# EAGLE design midi-in-board (EAGLE 7.5.0)
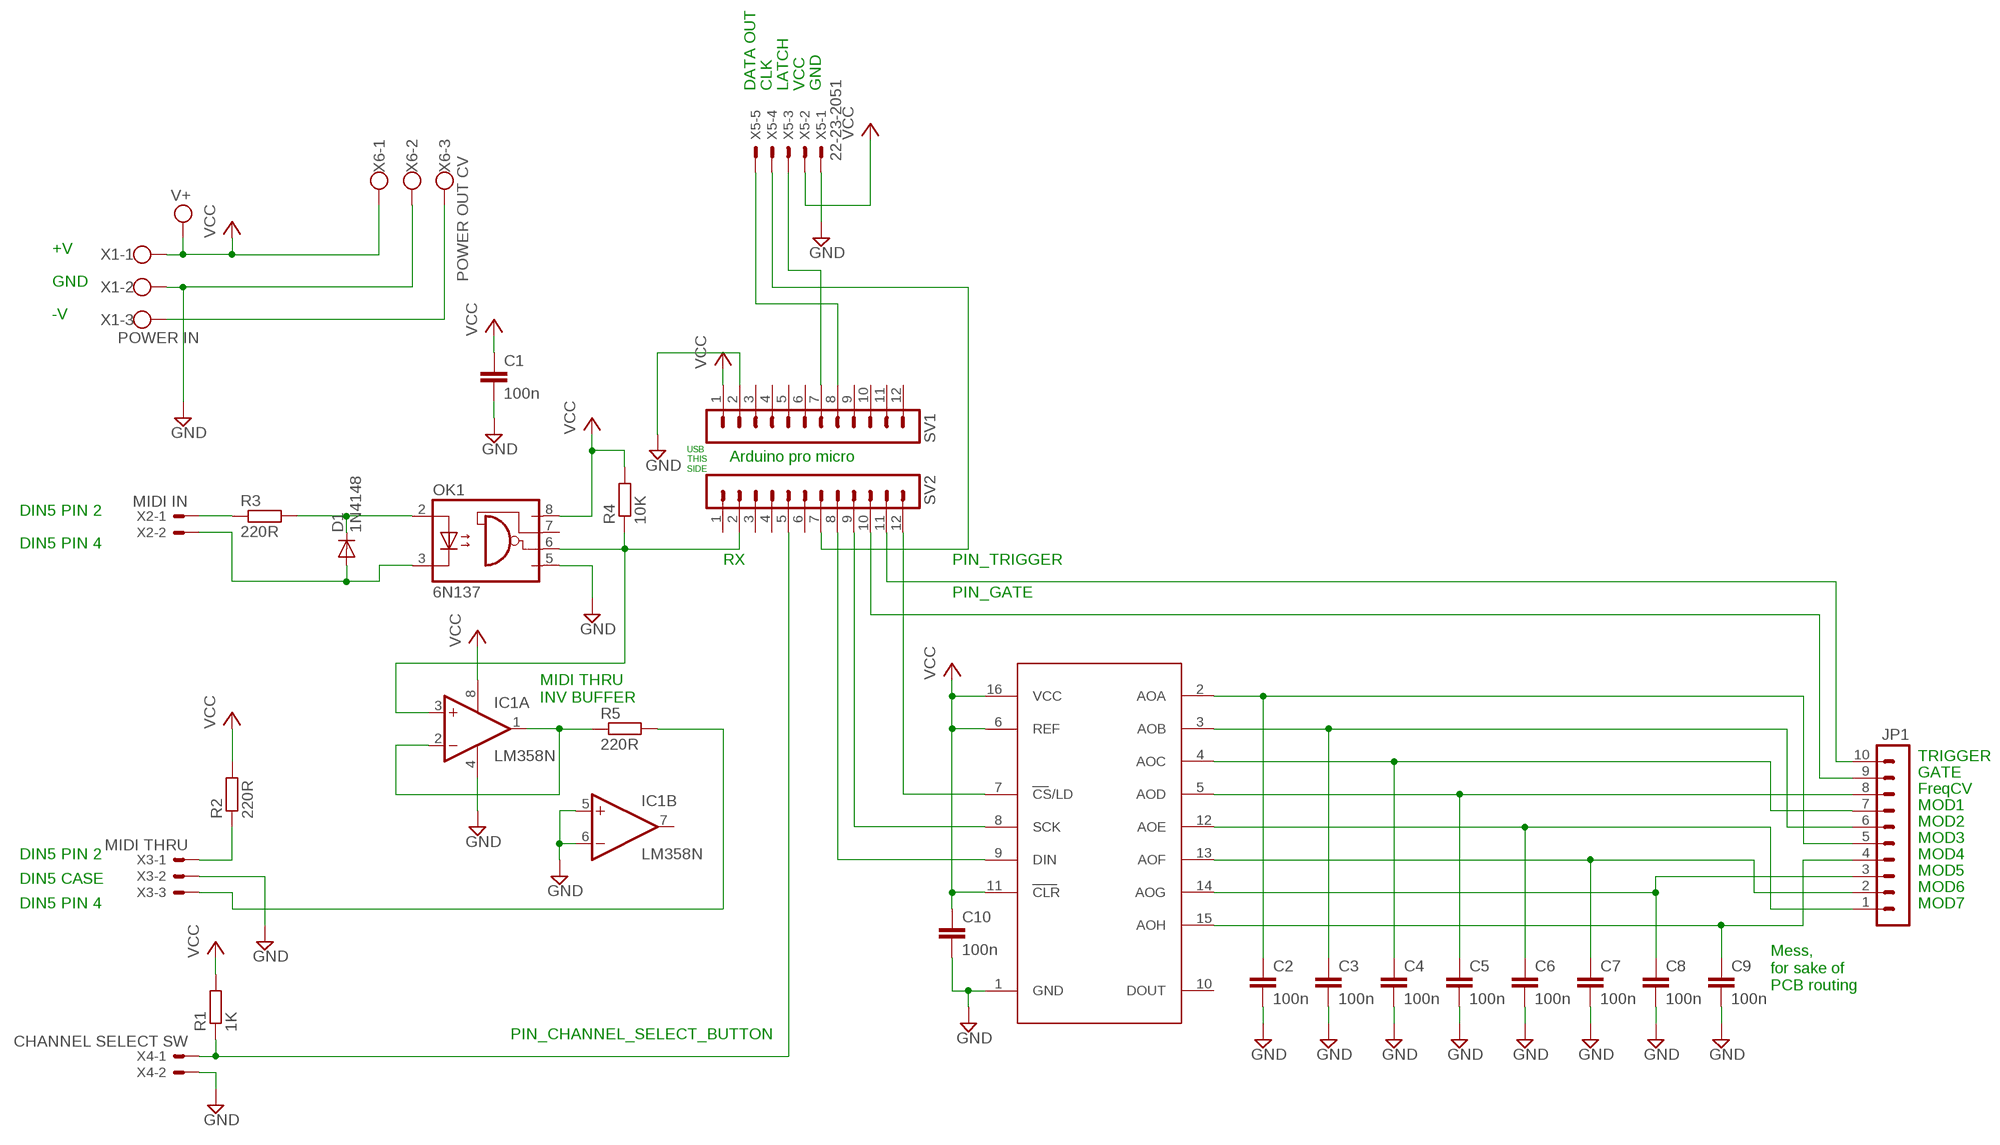
[diagram p0: schematic, sheet 1]

## Parts
C1  100n  C-EU050-024X044  [C050-024X044]
C2  100n  C-EU050-024X044  [C050-024X044]
C3  100n  C-EU050-024X044  [C050-024X044]
C4  100n  C-EU050-024X044  [C050-024X044]
C5  100n  C-EU050-024X044  [C050-024X044]
C6  100n  C-EU050-024X044  [C050-024X044]
C7  100n  C-EU050-024X044  [C050-024X044]
C8  100n  C-EU050-024X044  [C050-024X044]
C9  100n  C-EU050-024X044  [C050-024X044]
C10  100n  C-EU050-024X044  [C050-024X044]
D1  1N4148  1N4148DO35-7  [DO35-7]
IC1  LM358N  [DIL08]
JP1  MA10-1  [MA10-1]
OK1  6N137  [DIL08]
R1  1K  R-EU_0207/7  [0207/7]
R2  220R  R-EU_0207/7  [0207/7]
R3  220R  R-EU_0207/7  [0207/7]
R4  10K  R-EU_0207/7  [0207/7]
R5  220R  R-EU_0207/7  [0207/7]
SV1  MA12-1  [MA12-1]
SV2  MA12-1  [MA12-1]
U$1  LTC1660  [DIL16]
X1  POWER IN  W237-103  [W237-103]
X2  MIDI IN  22-23-2021  [22-23-2021]
X3  MIDI THRU  22-23-2031  [22-23-2031]
X4  CHANNEL SELECT SW  22-23-2021  [22-23-2021]
X5  22-23-2051  [22-23-2051]
X6  POWER OUT CV  W237-103  [W237-103]

## Nets
GND: C1.2 C2.2 C3.2 C4.2 C5.2 C6.2 C7.2 C8.2 C9.2 C10.2 IC1.4(P:V-) IC1.5(B:+IN) IC1.6(B:-IN) OK1.5(GND) SV1.2 U$1.1(GND) X1.2 X3.2 X4.2 X5.1 X6.2
N$1: R3.1 X2.1
N$2: D1.C OK1.2(A) R3.2
N$3: D1.A OK1.3(C) X2.2
N$4: IC1.1(A:OUT) IC1.2(A:-IN) R5.1
N$5: IC1.3(A:+IN) OK1.6(VO) R4.1 SV2.2
N$6: R2.1 X3.1
N$7: R5.2 X3.3
N$9: SV1.8 X5.5
N$10: X1.3 X6.3
N$11: JP1.10 SV2.11
N$12: JP1.9 SV2.10
N$14: R1.1 SV2.5 X4.1
N$16: SV2.9 U$1.8(SCK)
N$17: SV2.8 U$1.9(DIN)
N$22: C2.1 JP1.5 U$1.2(AOA)
N$23: SV2.12 U$1.7(CS/LD)
N$24: SV2.7 X5.4
N$26: SV1.7 X5.3
N$27: C3.1 JP1.6 U$1.3(AOB)
N$31: C6.1 JP1.1 U$1.12(AOE)
N$33: C4.1 JP1.7 U$1.4(AOC)
N$34: C5.1 JP1.8 U$1.5(AOD)
N$36: C7.1 JP1.2 U$1.13(AOF)
N$37: C8.1 JP1.3 U$1.14(AOG)
N$38: C9.1 JP1.4 U$1.15(AOH)
VCC: C1.1 C10.1 IC1.8(P:V+) OK1.8(VCC) R1.2 R2.2 R4.2 SV1.1 U$1.6(REF) U$1.11(CLR) U$1.16(VCC) X1.1 X5.2 X6.1 ; supply symbol labelled V+
Unconnected: IC1.7(B:OUT) OK1.7(VE) SV1.3 SV1.4 SV1.5 SV1.6 SV1.9 SV1.10 SV1.11 SV1.12 SV2.1 SV2.3 SV2.4 SV2.6 U$1.10(DOUT)

## Notes on the sheet
- DATA OUT | CLK | LATCH | VCC | GND
- +V
- GND
- -V
- Arduino pro micro
- USB
  THIS
  SIDE
- DIN5 PIN 2
- DIN5 PIN 4
- RX | PIN_TRIGGER
- PIN_GATE
- MIDI THRU
  INV BUFFER
- TRIGGER
- GATE
- FreqCV
- MOD1
- MOD2
- MOD3
- DIN5 PIN 2 | MOD4
- MOD5
- DIN5 CASE
- MOD6
- DIN5 PIN 4 | MOD7
- Mess,
  for sake of
  PCB routing
- PIN_CHANNEL_SELECT_BUTTON

## Library data of the parts
C1-C10 = rcl:C-EU: CAPACITOR, European symbol
D1 = diode:1N4148: DIODE high speed (Philips)
IC1 = linear:LM358: OP AMP also LM158; LM258; LM2904 Source: http://cache.national.com/ds/LM/LM158.pdf
JP1 = con-lstb:MA10-1: PIN HEADER; OC_FARNELL: unknown; OC_NEWARK: unknown
OK1 = optocoupler:6N137: MOTOROLA OPTO COUPLER; MPN: 6N137; OC_FARNELL: 1328376; OC_NEWARK: 52M1895
R1-R5 = rcl:R-EU_: RESISTOR, European symbol
SV1 SV2 = con-lstb:MA12-1: PIN HEADER; OC_FARNELL: unknown; OC_NEWARK: unknown
U$1 = LTC1660:LTC1660: Micropower octal 10-Bit DAC
X1 X6 = con-wago-500:W237-103: WAGO SCREW CLAMP; MPN: 237-103; OC_FARNELL: unknown; OC_NEWARK: 18M7116
X2 X4 = con-molex:22-23-2021: .100" (2.54mm) Center Header - 2 Pin; MF: MOLEX; MPN: 22-23-2021; OC_FARNELL: 1462926; OC_NEWARK: 25C3832
X3 = con-molex:22-23-2031: .100" (2.54mm) Center Header - 3 Pin; MF: MOLEX; MPN: 22-23-2031; OC_FARNELL: 1462950; OC_NEWARK: 30C0862
X5 = con-molex:22-23-2051: .100" (2.54mm) Center Header - 5 Pin; MF: MOLEX; MPN: 22-23-2051; OC_FARNELL: 1462952; OC_NEWARK: 38C9178

## Board
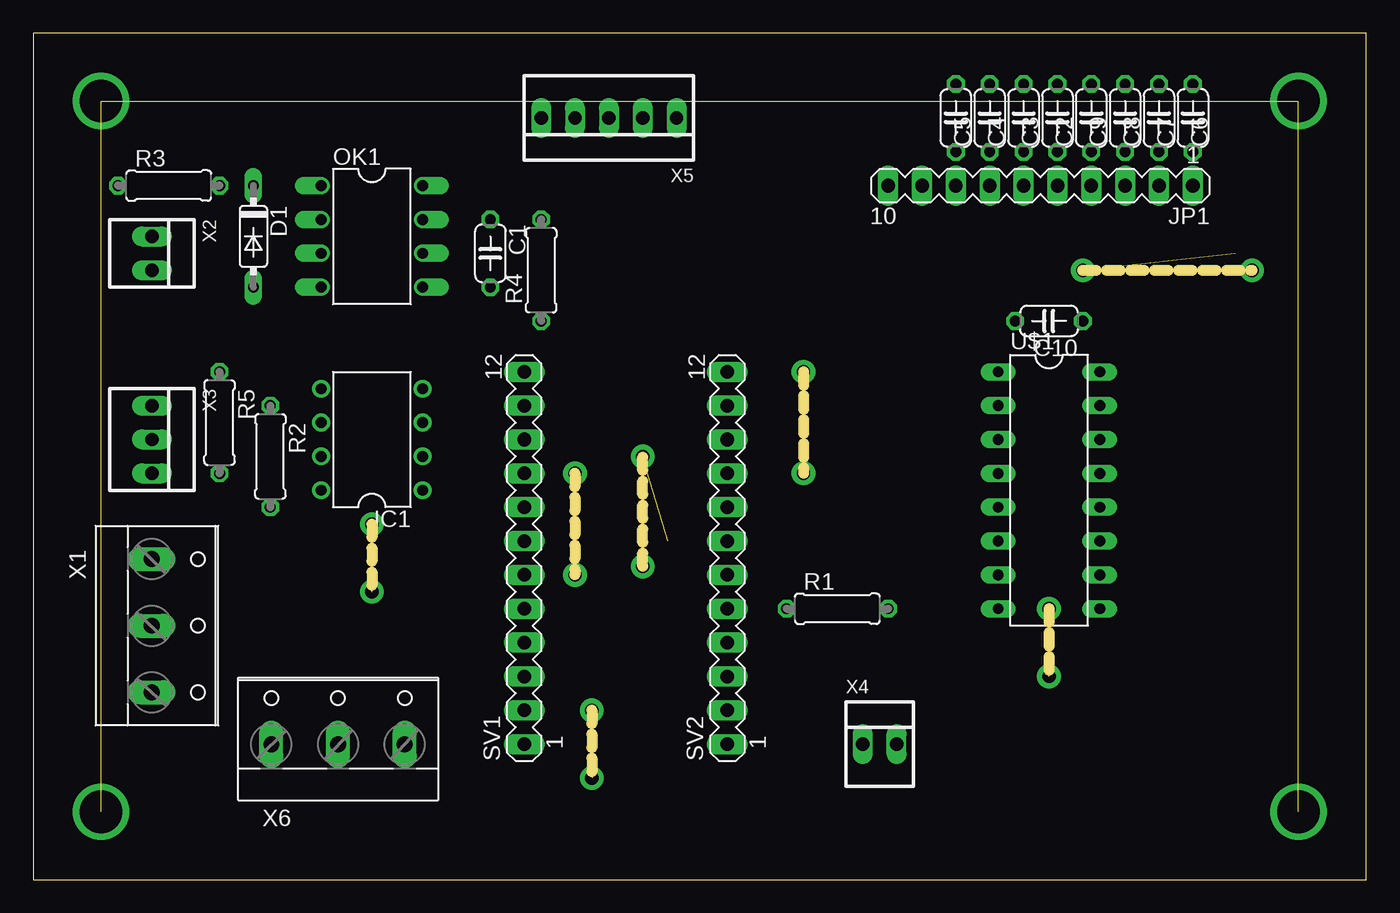
[diagram p1: board, top side]
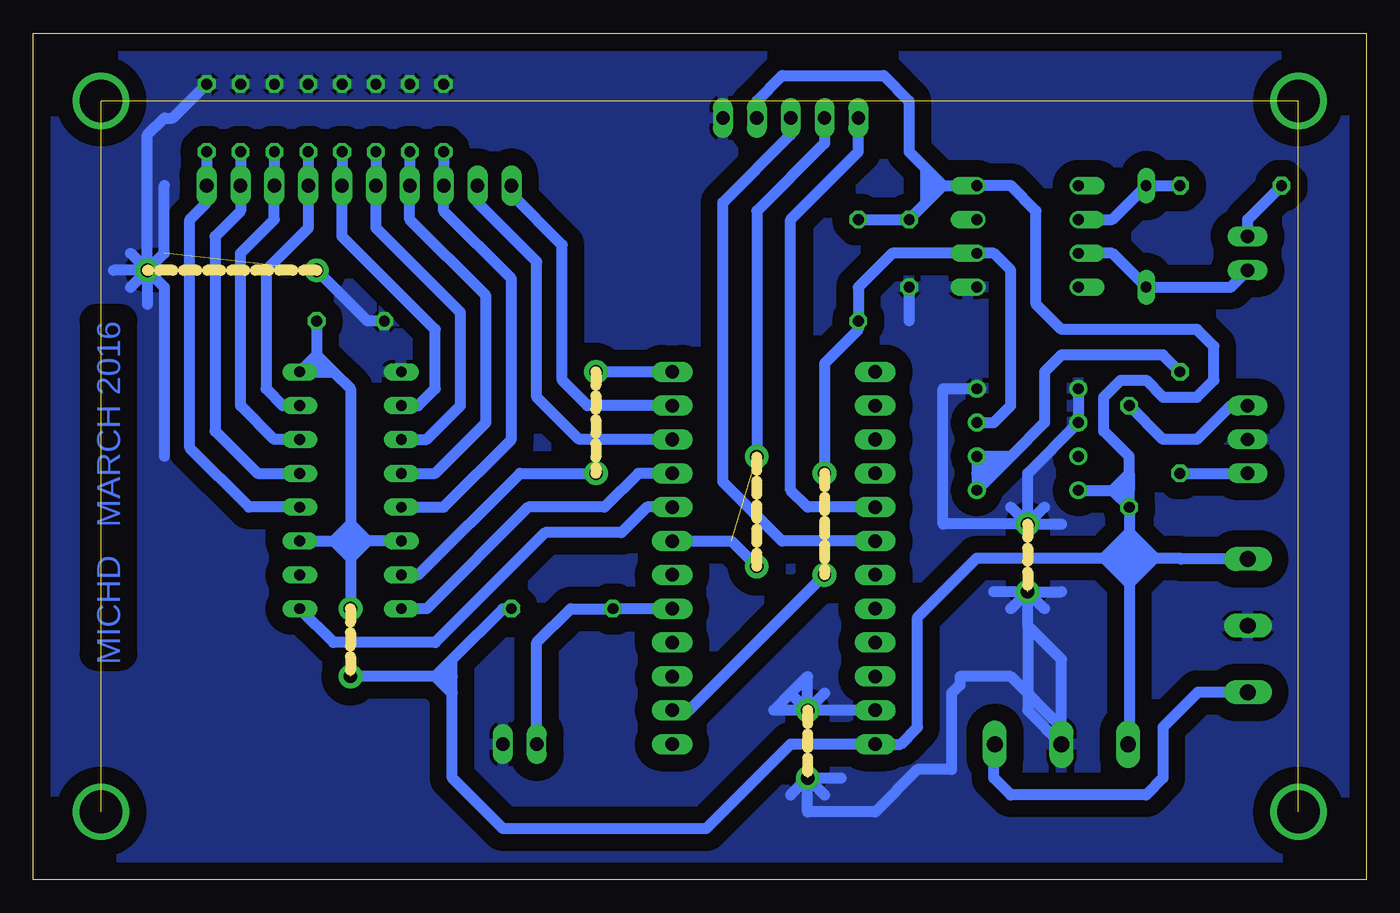
[diagram p2: board, bottom side, seen from below]

Size 100 x 63.5 mm. Coordinates in mm from the lower left corner, seen from the top.
Outline: 45.72,23.5 45.72,31.75
Outline: 40.64,30.48 40.64,22.86
Outline: 57.78,38.1 57.78,30.48
Outline: 76.2,20.32 76.2,15.24
Outline: 78.74,45.72 91.44,45.72
Outline: 25.4,26.67 25.4,21.59
Outline: 41.91,12.7 41.91,7.62
Outline: 0,0 100,0 100,63.5 0,63.5 0,0
Copper layers (1*16): Top 0.035mm / dielectric 1.5mm / Bottom 0.035mm
Design rules "default": minimum track width 10mil, minimum drill 24mil, track to track 8mil, track to pad 8mil, pad to pad 8mil, via to via 8mil, smd to smd 8mil, copper to edge 40mil, drill to drill 8mil, minimum pad ring 10mil, minimum via ring 8mil, stop-mask expansion 4mil, vias tented up to drill 0mil, thermal gap 10mil

### Footprints (pad centres in the part's own frame; a part is rotated, then mirrored left to right if it is on the bottom)
C050-024X044 = drill 0.813 octagon: 1 -2.54,0; 2 2.54,0
DO35-7 = drill 0.813 long: A 3.81,0; C -3.81,0
DIL08 = drill 0.813 pad 1.27: 1 -3.81,-3.81; 2 -1.27,-3.81; 3 1.27,-3.81; 4 3.81,-3.81; 5 3.81,3.81; 6 1.27,3.81; 7 -1.27,3.81; 8 -3.81,3.81
MA10-1 = drill 1.016 long: 1 -11.43,0; 2 -8.89,0; 3 -6.35,0; 4 -3.81,0; 5 -1.27,0; 6 1.27,0; 7 3.81,0; 8 6.35,0; 9 8.89,0; 10 11.43,0
DIL08' = drill 0.813 offset: 1 -3.81,-3.81; 2 -1.27,-3.81; 3 1.27,-3.81; 4 3.81,-3.81; 5 3.81,3.81; 6 1.27,3.81; 7 -1.27,3.81; 8 -3.81,3.81
0207/7 = drill 0.813 octagon: 1 -3.81,0; 2 3.81,0
MA12-1 = drill 1.016 long: 1 -13.97,0; 2 -11.43,0; 3 -8.89,0; 4 -6.35,0; 5 -3.81,0; 6 -1.27,0; 7 1.27,0; 8 3.81,0; 9 6.35,0; 10 8.89,0; 11 11.43,0; 12 13.97,0
DIL16 = drill 0.813 long: 1 -8.89,-3.81; 2 -6.35,-3.81; 3 -3.81,-3.81; 4 -1.27,-3.81; 5 1.27,-3.81; 6 3.81,-3.81; 7 6.35,-3.81; 8 8.89,-3.81; 9 8.89,3.81; 10 6.35,3.81; 11 3.81,3.81; 12 1.27,3.81; 13 -1.27,3.81; 14 -3.81,3.81; 15 -6.35,3.81; 16 -8.89,3.81
W237-103 = drill 1.194 long: 1 -5,-1.29; 2 0,-1.29; 3 5,-1.29
22-23-2021 = drill 1 long: 1 -1.27,0; 2 1.27,0
22-23-2031 = drill 1 long: 1 -2.54,0; 2 0,0; 3 2.54,0
22-23-2051 = drill 1 long: 1 -5.08,0; 2 -2.54,0; 3 0,0; 4 2.54,0; 5 5.08,0

### Placement (x,y rotation side)
C1  34.29,46.99 270 top
C2  76.83,57.15 90 top
C3  74.3,57.15 90 top
C4  71.75,57.15 90 top
C5  69.22,57.15 90 top
C6  87,57.15 90 top
C7  84.45,57.15 90 top
C8  81.92,57.15 90 top
C9  79.38,57.15 90 top
C10  76.2,41.91 180 top
D1  16.51,48.26 270 top
IC1  25.4,33.02 90 top
JP1  75.56,52.07 180 top
OK1  6N137  [DIL08']  25.4,48.26 270 top
R1  60.33,20.32 0 top
R2  17.78,31.75 270 top
R3  10.16,52.07 0 top
R4  38.1,45.72 90 top
R5  13.97,34.29 270 top
SV1  36.83,24.13 90 top
SV2  52.07,24.13 90 top
U$1  76.2,29.21 270 top
X1  10.16,19.05 270 top
X2  8.89,46.99 270 top
X3  8.89,33.02 270 top
X4  63.5,10.16 0 top
X5  43.18,57.15 180 top
X6  22.86,11.43 0 top

### Tracks (layer width: path | path; a pad name or v marks a point on that pad's centre or on a via)
GND  (via drill 1 pad 1.78)  (3 unrouted)
  Bottom 0.813: C1.2 34.29,41.91 | IC1.5 IC1.6 25.4,30.48 v25.4,26.67 | C10.2 74.93,41.91 78.74,45.72 | SV1.2 v41.91,12.7 | X6.2 22.86,10.16 | 22.86,11.43 22.86,16.51 25.4,19.05 | 25.4,19.05 v25.4,21.59 | v25.4,26.67 31.75,26.67 31.75,36.83 IC1.4 | 25.4,19.05 25.4,12.7 22.86,10.16 | 22.86,10.16 22.86,11.43 | 22.86,11.43 26.67,15.24 30.48,15.24 30.48,14.61 31.11,13.97 31.11,8.26 33.66,8.26 36.83,5.08 41.91,5.08 v41.91,7.62 | v41.91,12.7 41.91,15.24 43.18,13.97 | 43.18,13.97 44.45,12.7 v41.91,12.7 | v41.91,7.62 39.37,7.62 | v41.91,7.62 43.18,6.35 | v41.91,7.62 40.64,6.35 | v41.91,12.7 40.64,13.97 | v41.91,12.7 43.18,13.97 | v25.4,21.59 27.94,21.59 | v25.4,21.59 22.86,21.59 | v25.4,26.67 22.86,26.67 | v91.44,45.72 91.44,55.88 90.17,57.15 89.53,57.15 C6.2 | v91.44,45.72 93.98,45.72 | v91.44,45.72 91.44,43.18 | v91.44,45.72 92.71,44.45 | v91.44,45.72 92.71,46.99 | 90.17,52.07 90.17,46.99 v91.44,45.72 | v91.44,45.72 90.17,44.45 90.17,31.75 | v25.4,21.59 26.67,20.32 | v25.4,21.59 24.13,20.32 | v25.4,26.67 26.67,27.94 | v25.4,26.67 24.13,27.94
  pour Bottom (isolate 1.27): 1.27,62.23 98.73,62.23 98.73,1.27 1.27,1.27
N$1
  Bottom 0.813: X2.1 8.89,49.53 R3.1
N$2
  Bottom 0.813: R3.2 D1.C 19.05,49.53 OK1.2
N$3
  Bottom 0.813: OK1.3 19.05,46.99 D1.A 10.16,44.45 X2.2
N$4
  Bottom 0.813: 29.21,30.48 IC1.1 27.94,30.48 | R5.1 15.24,39.37 22.86,39.37 24.13,38.1 24.13,34.29 26.67,31.75 | 26.67,31.75 27.94,31.75 | 27.94,31.75 IC1.2 | 26.67,31.75 27.94,30.48 | 27.94,30.48 IC1.2 | IC1.2 29.21,30.48 | 29.21,30.48 27.94,30.48 | 27.94,30.48 27.94,31.75
N$5  (1 unrouted)
  Bottom 0.813: SV2.2 50.8,12.7 40.64,22.86 | IC1.3 27.94,34.29 26.67,35.56 26.67,45.72 27.94,46.99 OK1.6 35.56,46.99 38.1,44.45 R4.1 38.1,41.27 40.64,38.73 40.64,30.48
N$6
  Bottom 0.813: X3.1 10.16,35.56 12.7,33.02 15.24,33.02 R2.1
N$7
  Bottom 0.813: R5.2 X3.3
N$8  (via drill 1 pad 1.78)
  other vias: 57.78,38.1
N$9
  Bottom 0.813: SV1.8 41.91,27.94 43.18,29.21 43.18,49.53 38.1,54.61 X5.5
N$10
  Bottom 0.813: X1.3 12.62,14.05 15.24,11.43 15.24,7.62 16.51,6.35 26.67,6.35 27.94,7.62 27.94,10.06 X6.3
N$11
  Bottom 0.813: SV2.11 58.42,35.56 60.33,37.47 60.33,47.62 64.14,51.44 JP1.10
N$12
  Bottom 0.813: SV2.10 59.05,33.02 62.23,36.2 62.23,46.35 66.67,50.8 JP1.9
N$13  (via drill 1 pad 1.78)
  other vias: 57.78,30.48
N$14
  Bottom 0.813: SV2.5 R1.1 59.69,20.32 62.23,17.78 X4.1
N$15  (via drill 1 pad 1.78)
  other vias: 78.74,45.72
N$16
  Bottom 0.813: SV2.9 54.61,30.48 57.15,27.94 62.87,27.94 70.48,20.32 U$1.8
N$17
  Bottom 0.813: SV2.8 53.98,27.94 55.88,26.04 61.59,26.04 69.85,17.78 77.47,17.78 U$1.9
N$18  (via drill 1 pad 1.78)
  other vias: 76.2,20.32
N$19  (via drill 1 pad 1.78)
  other vias: 40.64,22.86
N$20  (via drill 1 pad 1.78)
  other vias: 40.64,30.48
N$21
  pour Bottom (isolate 1.27): 35.56,58.42 36.83,58.42 36.83,54.61 41.91,49.53 41.91,39.37 39.37,41.91 39.37,45.72 36.83,48.26 38.1,48.26 39.37,49.53 38.1,50.8 34.29,50.8 34.29,53.34 35.56,54.61
N$22
  Bottom 0.813: U$1.2 71.12,35.56 69.85,36.83 69.85,41.27 76.83,48.26 JP1.5 C2.1
N$23  (1 unrouted)
  Bottom 0.813: SV2.12 57.78,38.1 | U$1.7 71.12,22.86 63.5,30.48 57.78,30.48
N$24  (via drill 1 pad 1.78)  (1 unrouted)
  Bottom 0.813: SV2.7 47.62,25.4 | X5.4 40.64,55.24 45.72,50.16 v45.72,31.75 | 47.62,25.4 v45.72,23.5 47.62,25.4
N$26
  Bottom 0.813: SV1.7 43.81,25.4 48.26,29.84 48.26,50.8 43.18,55.88 X5.3
N$27
  Bottom 0.813: U$1.3 70.48,33.02 67.94,35.56 67.94,42.55 74.3,48.9 JP1.6 C3.1
N$28
  pour Bottom (isolate 1.27): 53.34,26.67 54.61,26.67 55.88,25.4 60.96,25.4 64.77,21.59 62.23,19.05 59.69,21.59 53.34,21.59
N$29
  pour Bottom (isolate 1.27): 49.53,24.13 49.53,15.24 41.91,22.86 41.91,24.13 44.45,24.13 44.45,22.86 46.99,22.86 48.26,24.13
N$31
  Bottom 0.813: U$1.12 83.82,27.94 88.27,32.38 88.27,49.53 87,50.8 JP1.1 C6.1
N$32
  pour Bottom (isolate 1.27): 62.23,35.56 63.5,35.56 63.5,31.75 58.42,31.75
N$33
  Bottom 0.813: U$1.4 69.85,30.48 66.04,34.29 66.04,43.81 71.75,49.53 JP1.7 C4.1
N$34
  Bottom 0.813: U$1.5 69.22,27.94 64.14,33.02 64.14,45.09 69.22,50.16 JP1.8 C5.1
N$36
  Bottom 0.813: U$1.13 83.19,30.48 86.36,33.66 86.36,48.26 84.45,50.16 JP1.2 C7.1
N$37
  Bottom 0.813: U$1.14 81.92,33.02 84.45,35.56 84.45,46.99 81.92,49.53 JP1.3 C8.1
N$38
  Bottom 0.813: U$1.15 81.28,35.56 82.55,36.83 82.55,45.72 79.38,48.9 JP1.4 C9.1
N$50  (via drill 3.2 pad 4)  (3 unrouted)
  other vias: 5.08,58.42 94.92,58.42 5.08,5.08 94.92,5.08
VCC  (via drill 1 pad 1.78)  (1 unrouted)
  Bottom 0.813: IC1.8 19.05,29.21 | 19.05,29.21 R2.2 | R2.2 17.78,29.21 | 17.78,30.48 17.78,31.75 19.68,33.66 19.68,36.2 18.41,37.47 16.51,37.47 15.24,36.2 12.7,36.2 11.43,37.47 11.43,40.01 12.7,41.27 22.86,41.27 24.77,43.18 24.77,50.16 26.67,52.07 OK1.8 31.75,52.07 | 19.05,29.21 17.78,30.48 | 17.78,30.48 17.78,29.21 | 17.78,29.21 19.05,29.21 | 33.02,50.8 C1.1 R4.2 | 33.02,50.8 32.38,51.44 | 32.38,51.44 31.75,52.07 | X1.1 13.89,24.05 13.97,24.13 14.61,24.13 | 15.24,24.13 14.61,24.13 | X5.2 45.72,58.42 43.81,60.33 36.2,60.33 34.29,58.42 34.29,54.61 33.02,53.34 | 33.02,53.34 32.38,52.7 | 32.38,52.7 31.75,52.07 | C10.1 78.74,39.37 | 78.74,39.37 U$1.16 78.74,38.1 | 78.74,38.1 77.47,38.1 | 77.47,38.1 76.2,36.83 76.2,26.67 | 76.2,26.67 74.93,25.4 | U$1.11 77.47,25.4 | 77.47,25.4 76.2,26.67 | 76.2,25.4 77.47,25.4 | 76.2,26.67 76.2,25.4 | 77.47,38.1 78.74,39.37 | 78.74,38.1 78.74,39.37 | U$1.6 74.93,25.4 | 74.93,25.4 76.2,25.4 | 76.2,25.4 76.2,24.13 | 76.2,24.13 76.2,20.32 | 74.93,25.4 76.2,24.13 | 76.2,24.13 77.47,25.4 | R1.2 64.77,20.32 68.58,16.51 | 68.58,16.51 69.85,15.24 | 69.85,15.24 v76.2,15.24 | 32.38,51.44 32.38,52.7 | 33.02,50.8 33.02,53.34 | 19.68,24.13 29.21,24.13 33.66,19.68 33.66,11.43 34.92,10.16 SV1.1 43.18,10.16 49.53,3.81 64.77,3.81 68.58,7.62 68.58,13.97 | 19.68,24.13 19.05,24.13 | 19.05,24.13 16.51,24.13 | 16.51,24.13 15.88,24.13 | 15.88,24.13 14.61,24.13 | 68.58,13.97 69.85,15.24 | 68.58,13.97 68.58,15.24 | 68.58,15.24 68.58,16.51 | 69.85,15.24 68.58,15.24 | R2.2 17.78,26.04 | 17.78,26.04 17.78,25.4 | 17.78,25.4 17.78,22.86 | 17.78,22.86 17.78,22.23 | 17.78,22.23 17.78,10.22 X6.1 | 16.51,24.13 17.78,25.4 | 17.78,25.4 19.05,24.13 | 19.05,24.13 17.78,22.86
  Bottom 0.813: 17.78,22.86 16.51,24.13 | 19.68,24.13 17.78,26.04 | 17.78,26.04 15.88,24.13 | 15.88,24.13 17.78,22.23 | 17.78,22.23 19.68,24.13

### Text on the board
Bottom: MICHD MARCH 2016